# Altium schematic sheet Schematic 1.0.SchDoc
size A4; SheetNumber: 1; SheetTotal: 1
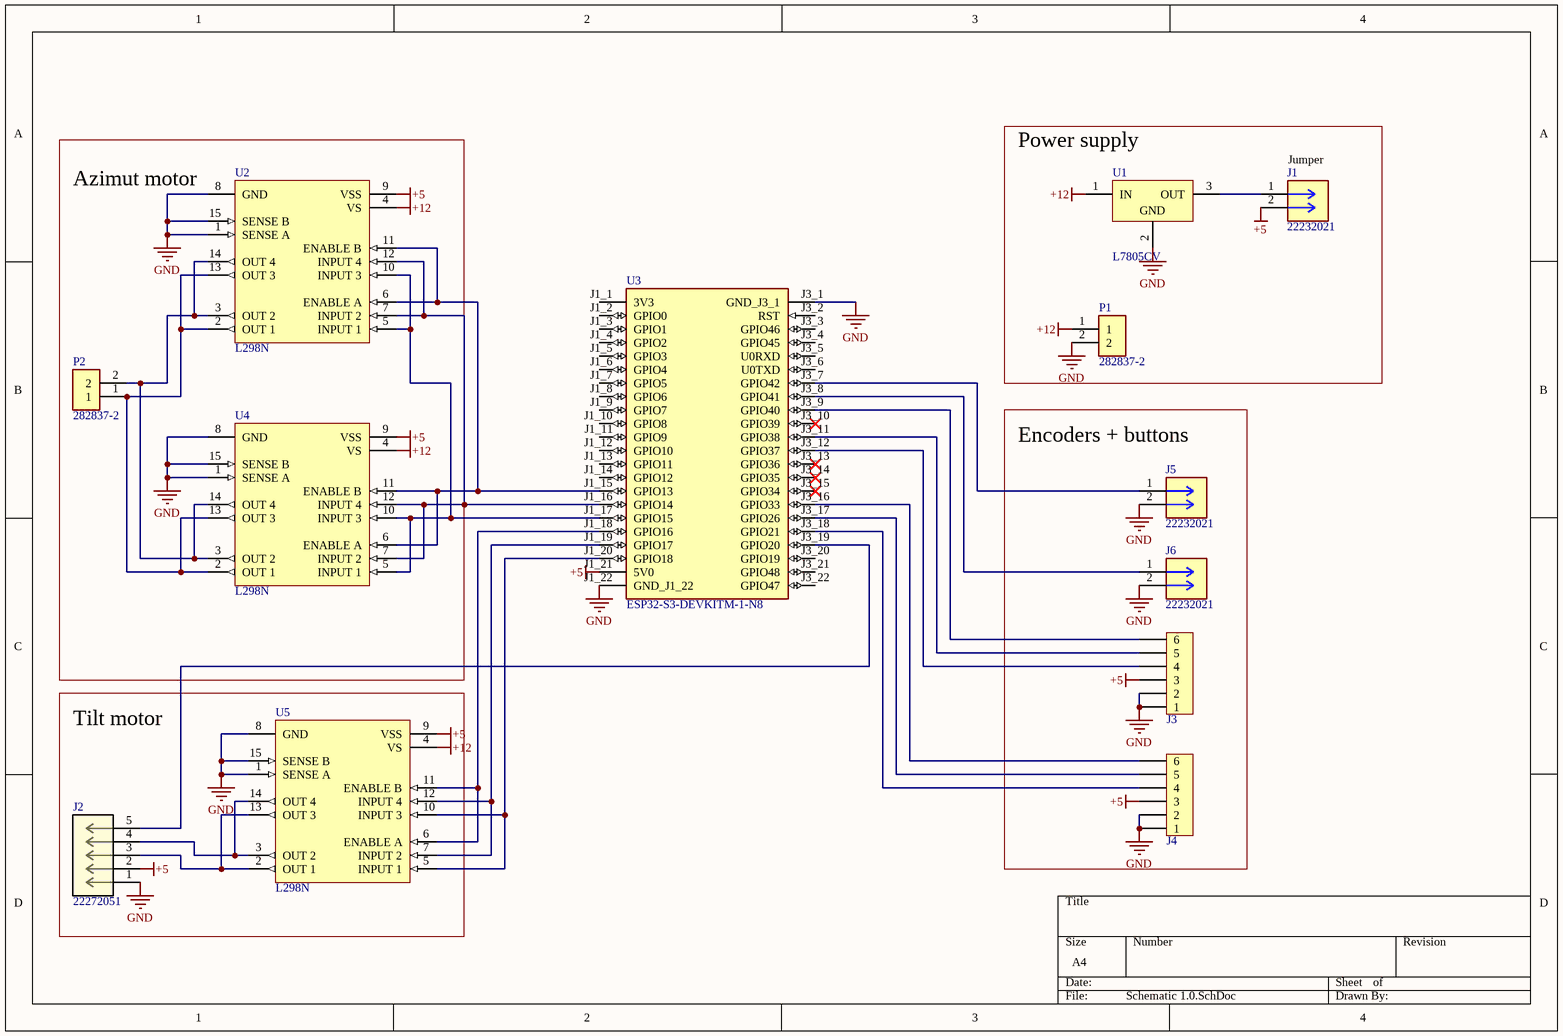
[diagram p0: Schematic 1.0.SchDoc]

## Parts
J1  22232021  [CONN_A-6373-02A_MOL]
J2  22272051  [CONN_AE-6410-05A_MOL]
J3  Header 1x6  [Header 1x6]  (value not drawn)
J4  Header 1x6  [Header 1x6]  (value not drawn)
J5  22232021  [CONN_A-6373-02A_MOL]
J6  22232021  [CONN_A-6373-02A_MOL]
P1  282837-2  [TE_282837-2]
P2  282837-2  [TE_282837-2]
U1  L7805CV  [TO220]
U2  L298N  [STM-FM-15]
U3  ESP32-S3-DEVKITM-1-N8  [MODULE_ESP32-S3-DEVKITM-1-N8]
U4  L298N  [STM-FM-15]
U5  L298N  [STM-FM-15]

## Blocks framed on the sheet
Power supply: J1 P1 U1

## Nets
+5: J1.2 J2.2 J3.3 J4.3 U2.9(VSS) U3.J1_21(5V0) U4.9(VSS) U5.9(VSS)
+12: P1.1 U1.1(IN) U2.4(VS) U4.4(VS) U5.4(VS)
GND: J2.1 J3.1 J3.2 J4.1 J4.2 J5.2 J6.2 P1.2 U1.2(GND) U2.1(SENSE_A) U2.8(GND) U2.15(SENSE_B) U3.J1_22(GND_J1_22) U3.J3_1(GND_J3_1) U4.1(SENSE_A) U4.8(GND) U4.15(SENSE_B) U5.1(SENSE_A) U5.8(GND) U5.15(SENSE_B)
NetJ1_1: J1.1 U1.3(OUT)
NetJ2_3: J2.3 U5.2(OUT_1) U5.13(OUT_3)
NetJ2_4: J2.4 U5.3(OUT_2) U5.14(OUT_4)
NetJ2_5: J2.5 U3.J3_19(GPIO20)
NetJ3_4: J3.4 U3.J3_12(GPIO37)
NetJ3_5: J3.5 U3.J3_11(GPIO38)
NetJ3_6: J3.6 U3.J3_9(GPIO40)
NetJ4_4: J4.4 U3.J3_18(GPIO21)
NetJ4_5: J4.5 U3.J3_17(GPIO26)
NetJ4_6: J4.6 U3.J3_16(GPIO33)
NetJ5_1: J5.1 U3.J3_7(GPIO42)
NetJ6_1: J6.1 U3.J3_8(GPIO41)
NetP2_1: P2.1 U2.2(OUT_1) U2.13(OUT_3) U4.2(OUT_1) U4.13(OUT_3)
NetP2_2: P2.2 U2.3(OUT_2) U2.14(OUT_4) U4.3(OUT_2) U4.14(OUT_4)
NetU2_5: U2.5(INPUT_1) U2.10(INPUT_3) U3.J1_17(GPIO15) U4.5(INPUT_1) U4.10(INPUT_3)
NetU2_6: U2.6(ENABLE_A) U2.11(ENABLE_B) U3.J1_15(GPIO13) U4.6(ENABLE_A) U4.11(ENABLE_B)
NetU2_7: U2.7(INPUT_2) U2.12(INPUT_4) U3.J1_16(GPIO14) U4.7(INPUT_2) U4.12(INPUT_4)
NetU3_J1_18: U3.J1_18(GPIO16) U5.6(ENABLE_A) U5.11(ENABLE_B)
NetU3_J1_19: U3.J1_19(GPIO17) U5.7(INPUT_2) U5.12(INPUT_4)
NetU3_J1_20: U3.J1_20(GPIO18) U5.5(INPUT_1) U5.10(INPUT_3)

Not connected (* = marked no-connect by the designer): U3 J1_1(3V3) J1_2(GPIO0) J1_3(GPIO1) J1_4(GPIO2) J1_5(GPIO3) J1_6(GPIO4) J1_7(GPIO5) J1_8(GPIO6) J1_9(GPIO7) J1_10(GPIO8) J1_11(GPIO9) J1_12(GPIO10) J1_13(GPIO11) J1_14(GPIO12) J3_2(RST) J3_3(GPIO46) J3_4(GPIO45) J3_5(U0RXD) J3_6(U0TXD) J3_10(GPIO39)* J3_13(GPIO36)* J3_14(GPIO35)* J3_15(GPIO34)* J3_20(GPIO19) J3_21(GPIO48) J3_22(GPIO47)

## Notes on the sheet
- (near J1) Jumper
- (near U2) Azimut motor
- (near J5) Encoders + buttons
- Tilt motor

## Library data of the parts
J1 J5 J6 = CMP-005-000000-1: Connector Header Through Hole 2 position 0.100 (2.54mm); MF: Molex; Check_prices: https://www.snapeda.com/parts/22232021/Molex/view-part/?ref=eda; Design Item ID: 22232021; MP: 22232021; Component Type: Standard; Source: 22232021.SchLib; Value: *; Package: None; Pin Count: 2; SnapEDA_Link: https://www.snapeda.com/parts/22232021/Molex/view-part/?ref=snap
J2 = 22272051: KK 254 Wire-to-Board Header, Vertical, with Friction Lock, 5 Circuits, Tin (Sn) Plating; Manufacturer_Name: Molex Connector Corporation; Copyright: Copyright (C) 2025 Ultra Librarian. All rights reserved.; Manufacturer_Part_Number: 22272051; Datasheet: https://www.molex.com/en-us/products/part-detail-pdf/22272051?display=pdf; RefDes: RefDes; Type: Type
P1 P2 = CMP-007-000000-1: Ð Ð°Ð·ÑŠÐµÐ¼Ð½Ñ‹Ðµ ÐºÐ»ÐµÐ¼Ð¼Ð½Ñ‹Ðµ ÐºÐ¾Ð»Ð¾Ð´ÐºÐ¸ Ð Ð¾Ð·ÐµÑ‚ÐºÐ° 2 Ð¿Ð¾Ð»Ð¾Ð¶ÐµÐ½Ð¸Ñ 5,08 Ð¼Ð¼ ÐŸÑ€Ð¸Ð¿Ð¾Ð¹ Ð¿Ñ€ÑÐ¼Ð¾Ð¹ Ñ‡ÐµÑ€ÐµÐ· Ð¾Ñ‚Ð²ÐµÑ€ÑÑ‚Ð¸Ðµ 13,5 Ð / ÐºÐ¾Ð½Ñ‚Ð°ÐºÑ‚; MF: TE Connectivity; Price: None; MP: 282837-2; Check_prices: https://www.snapeda.com/parts/282837-2/TE+Connectivity+AMP+Connectors/view-part/?ref=eda; Value: *; Pin Count: 2; SnapEDA_Link: https://www.snapeda.com/parts/282837-2/TE+Connectivity+AMP+Connectors/view-part/?ref=snap; Component Type: Standard; Purchase-URL: https://pricing.snapeda.com/search/part/282837-2/?ref=eda; Availability: In Stock; Package: None; Source: 282837-2.SchLib; Design Item ID: 282837-2
U1 = CMP-0244-00483-1: Positive Voltage Regulator, 5V, 3-Pin TO-220; PackageDescription: TO, Thru-Hole, Vertical, Heatsink Mounted; 3 In-Line Leads; Pitch 2.54 mm; ComponentLink2Description: Datasheet; PackageReference: TO220; ComponentLink3URL: http://www.st.com/internet/com/TECHNICAL_RESOURCES/TECHNICAL_LITERATURE/PACKAGE_INFORMATION/CD00004649.pdf; DatasheetVersion: 16/11/2011; ComponentLink1Description: Manufacturer URL; ComponentLink1URL: http://www.st.com; PackageVersion: ver3.0; ComponentLink3Description: Package Specification; ComponentLink2URL: http://www.st.com/internet/com/TECHNICAL_RESOURCES/TECHNICAL_LITERATURE/DATASHEET/CD00000444.pdf
U2 U4 U5 = CMP-2000-06526-1: Dual Full-Bridge Driver, 4.8 to 46 V, -40 to 150 degC, 15-Pin FM (MW 15L), RoHS, Tube; Manufacturer: STMicroelectronics; PartNumber: L298; Output Current: 2A; Supply Voltage Max: 7V; Driver Case Style: Multiwatt; Supply Voltage Min: 4.5V; No. of Pins: 15Pins; SVHC: NoSVHC(17-Dec-2015); Output Voltage: 46V; No. of Outputs: 4Outputs; Motor Type: FullBridge; MSL: -; Package Description: 15-Pin Flange Mount, Body 5 x 19.6 mm, Pitch 1.27 mm; Datasheet Version: 01/2000; Package Reference: FM-15; Mounting Technology: ThroughHole; Packaging: Each; Automotive Qualification Standard: -; Product Range: -; Datasheet URL: https://datasheet.ciiva.com/15109/getdatasheetpartid-50682-15109332.pdf; Operating Temperature Max: 130°C; Operating Temperature Min: -25°C; Manufacturer URL: http://www.st.com/
U3 = CMP-003-000000-1: MF: {'manufacturer': u'Espressif Systems'}; Package: None; Value: *; Source: ESP32-S3-DEVKITM-1-N8.SchLib; Design Item ID: ESP32-S3-DEVKITM-1-N8; Price: None; Component Type: Standard; Availability: Unavailable; Pin Count: 44; MP: ESP32-S3-DEVKITM-1-N8